# EAGLE design SparkFun_9DoF_Sensor_Stick (EAGLE 7.2.0)
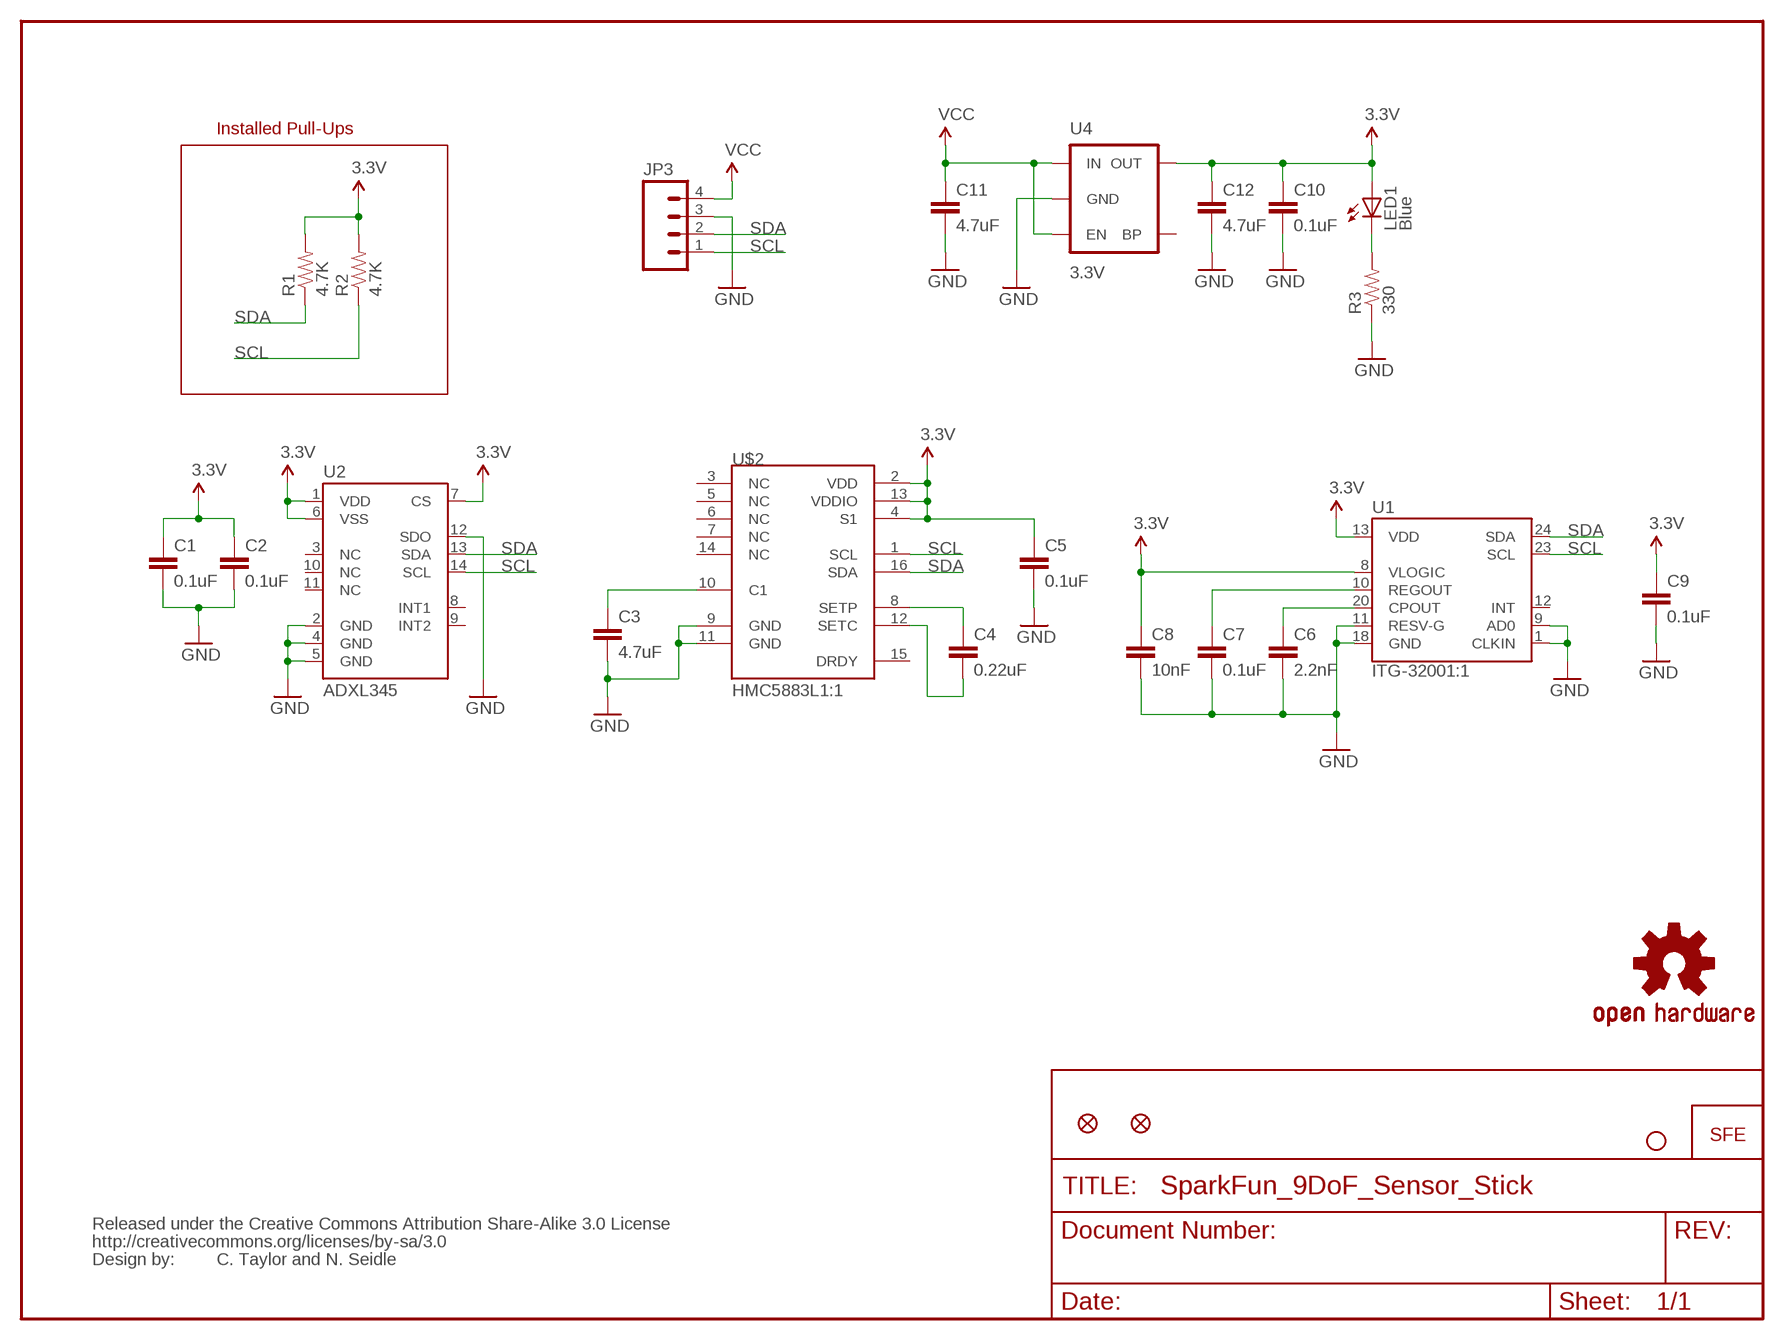
[diagram p0: schematic, sheet 1]

## Parts
C1  0.1uF  CAP0402-CAP  [0402-CAP]
C2  0.1uF  CAP0402-CAP  [0402-CAP]
C3  4.7uF  CAP0402-CAP  [0402-CAP]
C4  0.22uF  CAP0402-CAP  [0402-CAP]
C5  0.1uF  CAP0402-CAP  [0402-CAP]
C6  2.2nF  CAP0402-CAP  [0402-CAP]
C7  0.1uF  CAP0402-CAP  [0402-CAP]
C8  10nF  CAP0402-CAP  [0402-CAP]
C9  0.1uF  CAP0402-CAP  [0402-CAP]
C10  0.1uF  CAP0402-CAP  [0402-CAP]
C11  4.7uF  CAP0402-CAP  [0402-CAP]
C12  4.7uF  CAP0402-CAP  [0402-CAP]
JP1  FIDUCIAL1X2  [FIDUCIAL-1X2]
JP2  FIDUCIAL1X2  [FIDUCIAL-1X2]
JP3  M04PTH  [1X04]
JP4  LOGO-SFESK  [SFE-LOGO-FLAME]
JP5  STAND-OFF  [STAND-OFF]
LED1  Blue  LED0603  [LED-0603]
R1  4.7K  RESISTOR0402-RES  [0402-RES]
R2  4.7K  RESISTOR0402-RES  [0402-RES]
R3  330  RESISTOR0402-RES  [0402-RES]
U1  ITG-32001:1  [QFN-24_1:1]
U2  ADXL345  [LGA14]
U4  3.3V  V_REG_LDOSMD  [SOT23-5]
U$1  CREATIVE_COMMONS  [CREATIVE_COMMONS]
U$2  HMC5883L1:1  [16LPCC_1:1]
U$3  OSHW-LOGOS  [OSHW-LOGO-S]

## Nets
3.3V: C1.1 C2.1 C5.1 C8.1 C9.1 C10.1 C12.1 LED1.A R1.2 R2.2 U1.8(VLOGIC) U1.13(VDD) U2.1(VDD) U2.6(VSS) U2.7(CS) U4.5(OUT) U$2.2(VDD) U$2.4(S1) U$2.13(VDDIO)
GND: C1.2 C2.2 C3.2 C5.2 C6.2 C7.2 C8.2 C9.2 C10.2 C11.2 C12.2 JP3.3 R3.1 U1.1(CLKIN) U1.9(AD0) U1.11(RESV-G) U1.18(GND) U2.2(GND) U2.4(GND) U2.5(GND) U2.12(SDO) U4.2(GND) U$2.9(GND) U$2.11(GND)
N$1: C3.1 U$2.10(C1)
N$2: C4.1 U$2.8(SETP)
N$3: C4.2 U$2.12(SETC)
N$4: LED1.C R3.2
N$5: C6.1 U1.20(CPOUT)
N$7: C7.1 U1.10(REGOUT)
SCL: JP3.1 R2.1 U1.23(SCL) U2.14(SCL) U$2.1(SCL)
SDA: JP3.2 R1.1 U1.24(SDA) U2.13(SDA) U$2.16(SDA)
VCC: C11.1 JP3.4 U4.1(IN) U4.3(EN)
Unconnected: U1.12(INT) U2.3(NC) U2.8(INT1) U2.9(INT2) U2.10(NC) U2.11(NC) U4.4(BP) U$2.3(NC) U$2.5(NC) U$2.6(NC) U$2.7(NC) U$2.14(NC) U$2.15(DRDY)

## Notes on the sheet
- Installed Pull-Ups
- C. Taylor and N. Seidle

## Library data of the parts
C1-C12 = SparkFun:CAP: Capacitor Standard 0603 ceramic capacitor, and 0.1" leaded capacitor.
JP1 JP2 = SparkFun:FIDUCIAL: Fiducial Alignment Points Various fiducial points for machine vision alignment.
JP3 = SparkFun:M04: Header 4 Standard 4-pin 0.1" header. Use with straight break away headers (SKU : PRT-00116), right angle break away headers (PRT-00553), swiss pins (PRT-00743), machine pins (PRT-00117), and female headers (PRT-00115). Molex polarized connector foot print use with SKU : PRT-08231 with associated crimp pins and housings. 1MM SMD Version SKU: PRT-10208
JP4 = SparkFun:LOGO-SFE: Spark Fun Electronics PCB Logo This is the standard Spark Fun Electronics PCB logo.
JP5 = SparkFun:STAND-OFF: Stand Off This is the mechanical footprint for a #4 phillips button head screw. Use the keepout ring to avoid running the screw head into surrounding components. SKU : PRT-00447
LED1 = SparkFun:LED: LEDs Standard schematic elements and footprints for 5mm, 3mm, 1206, and 0603 sized LEDs. 5mm - Spark Fun Electronics SKU : COM-00529 (and others)
R1-R3 = SparkFun:RESISTOR: Resistor Basic schematic elements and footprints for 0603, 1206, and PTH resistors.
U1 = Testing:ITG-3200: ITG-3200 3-axis gyro, digital output, qfn24 package
U2 = SparkFun:ADXL345
U4 = SparkFun:V_REG_LDO: Voltage Regulator LDO Standard 150mA LDO voltage regulator in SOT-23 layout. Micrel part MIC5205. BP (by-pass) pin is used to lower output noise with 470pF cap.
U$1 = SparkFun:CREATIVE_COMMONS
U$2 = Testing:HMC5883L: 3 Axis Digital Compass IC
U$3 = SparkFun:OSHW-LOGO: Open Source Hardware Logo This logo indicates the piece of hardware it is found on incorporates a OSHW license and/or adheres to the definition of open source hardware found here: http://freedomdefined.org/OSHW

## Board
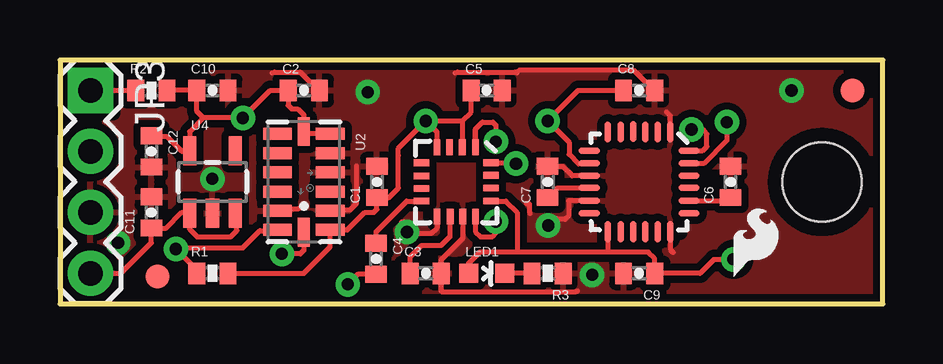
[diagram p1: board, top side]
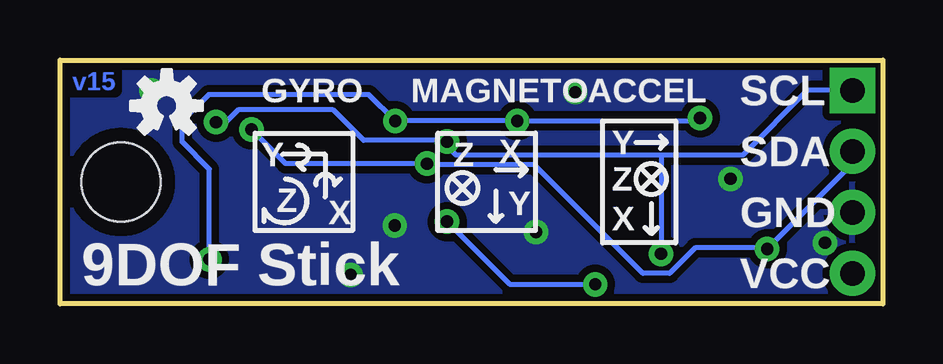
[diagram p2: board, bottom side, seen from below]

Size 34.29 x 10.16 mm. Coordinates in mm from the lower left corner, seen from the top.
Outline: 0,0 34.29,0 34.29,10.16 0,10.16 0,0
Copper layers (1*16): Top 0.035mm / dielectric 1.5mm / Bottom 0.035mm
Design rules "default": minimum track width 8mil, minimum drill 20mil, track to track 8mil, track to pad 8mil, pad to pad 8mil, via to via 8mil, smd to smd 8mil, copper to edge 8mil, drill to drill 8mil, minimum pad ring 12mil, minimum via ring 10mil, stop-mask expansion 4mil, vias tented up to drill 20mil, thermal gap 10mil
tRestrict: area 25.8,3 to 25.8,3; area 11.2,5.9 to 11.3,5.9; area 15.4,3.6 to 15.5,3.7

### Footprints (pad centres in the part's own frame; a part is rotated, then mirrored left to right if it is on the bottom)
0402-CAP = smd 0.7 x 0.9: 1 -0.65,0; 2 0.65,0
FIDUCIAL-1X2 = smd 1 x 1: 1 0,0
1X04 = drill 1.016 pad 1.88 square: 1 0,0 | drill 1.016 pad 1.88: 2 2.54,0; 3 5.08,0; 4 7.62,0
STAND-OFF = hole 3.302: 0,0
LED-0603 = smd 0.8 x 0.8: A 0,-0.75; C 0,0.75
0402-RES = smd 0.7 x 0.9: 1 -0.65,0; 2 0.65,0
QFN-24_1:1 = smd 0.889 x 0.279: 1 -2.076,1.301; 2 -2.076,0.775; 3 -2.076,0.25; 4 -2.102,-0.25; 5 -2.076,-0.775; 6 -2.076,-1.301; 13 2.076,-1.301; 14 2.076,-0.775; 15 2.076,-0.25; 16 2.076,0.25; 17 2.076,0.775; 18 2.076,1.301 | smd 0.279 x 0.889: 7 -1.301,-2.076; 8 -0.775,-2.076; 9 -0.25,-2.076; 10 0.25,-2.076; 11 0.775,-2.076; 12 1.301,-2.076; 19 1.301,2.076; 20 0.775,2.076; 21 0.25,2.076; 22 -0.25,2.076; 23 -0.775,2.076; 24 -1.301,2.076
LGA14 = smd 0.5 x 1.2: 1 2,1.1; 2 1.2,1.1; 3 0.4,1.1; 4 -0.4,1.1; 5 -1.2,1.1; 6 -2,1.1; 8 -2,-1.1; 9 -1.2,-1.1; 10 -0.4,-1.1; 11 0.4,-1.1; 12 1.2,-1.1; 13 2,-1.1 | smd 1.2 x 0.5: 7 -2.1,0; 14 2.1,0
SOT23-5 = smd 0.55 x 1.2: 1 -0.95,-1.3; 2 0,-1.3; 3 0.95,-1.3; 4 0.95,1.3; 5 -0.95,1.3
16LPCC_1:1 = smd 0.65 x 0.28: 1 -1.446,0.801; 2 -1.446,0.25; 3 -1.446,-0.275; 4 -1.446,-0.801; 9 1.446,-0.801; 10 1.446,-0.25; 11 1.446,0.275; 12 1.446,0.801 | smd 0.28 x 0.65: 5 -0.801,-1.446; 6 -0.25,-1.446; 7 0.275,-1.446; 8 0.801,-1.446; 13 0.801,1.446; 14 0.25,1.446; 15 -0.275,1.446; 16 -0.801,1.446

### Placement (x,y rotation side)
C1  13.21,5.08 90 top
C2  10.16,8.89 0 top
C3  15.24,1.27 0 top
C4  13.17,1.88 270 top
C5  17.78,8.89 0 top
C6  27.94,5.08 90 top
C7  20.32,5.08 90 top
C8  24.13,8.89 0 top
C9  24.13,1.27 180 top
C10  6.35,8.89 0 top
C11  3.81,3.81 90 top
C12  3.81,6.35 270 top
JP1  33.02,8.89 0 top
JP2  4.06,1.14 0 top
JP3  1.27,8.89 270 top
JP4  28.07,1.14 0 top
JP5  31.75,5.08 0 top
LED1  17.78,1.27 270 top
R1  6.35,1.27 0 top
R2  3.81,8.89 0 top
R3  20.32,1.27 180 top
U1  24.13,5.08 270 top
U2  10.16,5.08 270 top
U4  6.35,5.08 0 top
U$1  -13.97,-8.89 0 top  (outside the outline)
U$2  16.51,5.08 270 top
U$3  29.84,8.26 0 bottom

### Tracks (layer width: path | path; a pad name or v marks a point on that pad's centre or on a via)
3.3V  (via drill 0.51)
  Top 0.203: 16.76,7.62 U$2.2 | C8.1 21.59,8.89 v20.32,7.62 21.21,6.73 21.21,6.22 21.6,5.83 U1.8 | 5.97,7.75 v7.62,7.75 8.76,8.89 C2.1 9.51,8.27 9.65,8.13 9.91,8.13 10.16,7.87 U2.7 10.21,7.11 11.23,7.11 U2.6 | 5.97,7.75 5.7,8.02 C10.1 R2.2 | 5.97,7.75 5.4,7.18 U4.5 5.11,6.38 5.08,6.35 4.47,6.96 3.81,6.96 C12.1 | v15.24,7.62 16.76,7.62 | 19.05,2.16 19.05,3.81 18.58,4.28 U$2.13 | R1.2 10.16,1.27 11.26,2.37 U2.1 11.97,3.08 12.7,3.81 13.08,3.81 13.21,3.94 C1.1 13.7,4.43 14.1,4.83 14.1,6.17 14.1,6.47 v15.24,7.62 | U$2.4 15.71,7.15 v15.24,7.62 | C5.1 17.13,7.99 16.76,7.62 | 22.86,3.04 U1.13 22.83,2.19 22.86,2.16 | v28.06,1.85 27.25,1.85 26.67,1.27 C9.1 24.75,1.3 24.75,1.92 24.51,2.16 22.86,2.16 | 22.86,2.16 19.05,2.16 | 19.05,2.16 17.49,2.16 17.03,1.7 LED1.A
  Bottom 0.203: v7.62,7.75 7.75,7.62 v15.24,7.62 v20.32,7.62 21.42,8.72 28.1,8.72 29.2,7.62 29.2,6.75 28.06,5.62 v28.06,1.85
GND  (via drill 0.51)
  Top 0.203: U2.2 11.23,3.91 12.09,3.91 12.36,4.18 12.36,5.73 12.35,5.74 | 10.04,4.01 9.96,3.96 9.14,3.96 U2.12 | 14.22,3.4 14.34,3.42 | 19.58,3.76 19.56,3.86 19.56,4.17 19.44,4.18 | 21.57,0.53 21.49,0.51 15.89,0.51 C3.2 | 16.46,9.63 16.56,9.65 18.95,9.65 19.03,9.63 19.1,9.7 19.15,9.75 23.88,9.75 24.69,8.94 C8.2 | C2.2 10.72,8.94 10.01,9.65 8.94,9.65 8.84,9.63 | U1.1 25.43,7.84 25.27,8 | U1.9 21.34,5.33 20.95,5.71 20.34,5.71 C7.2 | 22.07,4.32 U1.11 21.21,4.3 21.19,4.29 21.19,3.65 21.06,3.52 20.74,3.52 20.7,3.56 | U1.18 25.43,2.26 25.56,2.13 | U$2.11 16.79,2.74 15.89,1.85 C3.2 | 15.89,1.18 C3.2 | U$2.9 15.71,3.16 15.71,3.15 15.48,2.92 14.53,2.92 v14.46,2.99
  other vias: 30.48,8.89 20.34,3.27 6.35,5.21 2.41,2.54 12.82,8.82 22.17,1.21
  pour Bottom (isolate 0.305): 0,10.16 0,0 34.29,0 34.29,10.16
  pour Top (isolate 0.305): 0,10.16 0,0 34.29,0 34.29,10.16
N$1
  Top 0.203: U$2.10 16.26,2.81 15.87,2.42 15.05,2.42 14.59,1.96 C3.1
N$2
  Top 0.203: U$2.8 14.44,4.28 13.17,3.01 C4.1
N$3  (via drill 0.51)
  Top 0.203: v18.16,3.43 18.16,2.95 18,2.79 17.53,2.79 17.31,3.01 U$2.12 | C4.2 12.4,1.23 v11.99,0.81
  Bottom 0.203: v18.16,3.43 15.54,0.81 v11.99,0.81
N$4
  Top 0.203: R3.2 LED1.C
N$5
  Top 0.203: 27.84,4.33 C6.1 27.82,4.3 U1.20
N$7
  Top 0.203: U1.10 20.72,4.83 C7.1
SCL  (via drill 0.51)
  Top 0.203: JP3.1 R2.1 | U1.23 26.16,5.84 26.82,5.84 27.79,6.81 v27.79,7.57 | 17.32,7.29 17.32,6.66 17.27,6.6 17.27,6.45 U$2.1 17.31,7.28 17.32,7.29 | 17.32,7.29 17.6,7.57 18.03,7.57 18.16,7.44 v18.16,6.76 | U2.14 10.16,2.23 10.02,2.08 v9.25,2.08
  Bottom 0.203: 9.25,6.2 5.84,6.2 R2.1 JP3.1 | 9.25,6.2 17.78,6.2 18.19,6.6 18.19,6.78 | v27.79,7.57 27.38,7.57 26.87,8.08 22.91,8.08 21.64,6.81 18.19,6.81 18.19,6.78 | 9.25,6.2 v9.25,2.08 | v18.16,6.76 18.19,6.78
SDA  (via drill 0.51)
  Top 0.203: U2.13 9.04,3.05 8.33,3.05 7.62,2.34 4.88,2.34 v4.83,2.29 5.57,1.54 5.7,1.54 R1.1 | U1.24 26.78,6.38 26.95,6.55 26.95,7.09 26.8,7.26 v26.31,7.26 | U$2.16 18.96,5.88 v19,5.84
  Bottom 0.203: v26.31,7.26 24.89,5.84 v19,5.84 18.9,5.79 14.53,5.79 10.01,1.27 8.89,1.27 7.82,2.34 4.88,2.34 v4.83,2.29 1.27,5.84 JP3.2
VCC
  Top 0.203: JP3.4 2.54,1.27 3.81,2.54 C11.1 4.43,3.16 5.08,3.81 5.37,3.81 U4.1 5.4,3.11 5.71,2.79 7.11,2.79 7.37,3.05 7.37,3.71 U4.3

### Text on the board
Bottom: v15
tPlace: C. Taylor and N. Seidle
bPlace: SCL | ACCEL | MAGNETO | GYRO | SDA | Y | X | Z | Y | Z | Y | Z | GND | X | X | VCC | 9DOF Stick